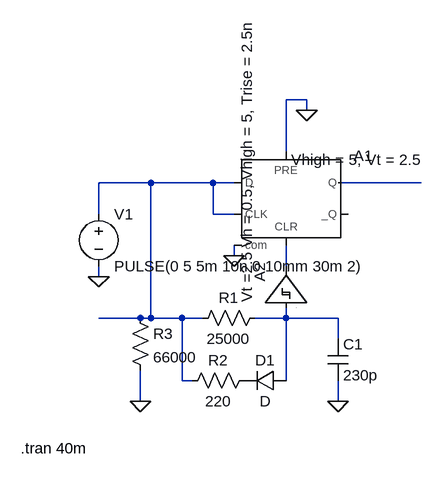
[diagram p0: schematic Dflop Transition Pulse Circuit TEST.asc]
Dflop Transition Pulse Circuit TEST.asc, the LTspice schematic file:
Version 4.1
SHEET 1 880 680
WIRE 496 -128 464 -128
WIRE 496 -112 496 -128
WIRE 464 -48 464 -128
WIRE 256 0 176 0
WIRE 352 0 256 0
WIRE 384 0 352 0
WIRE 672 0 544 0
WIRE 176 48 176 0
WIRE 352 48 352 0
WIRE 384 48 352 48
WIRE 384 112 384 96
WIRE 464 128 464 96
WIRE 176 144 176 128
WIRE 240 208 176 208
WIRE 256 208 256 0
WIRE 256 208 240 208
WIRE 304 208 256 208
WIRE 336 208 304 208
WIRE 464 208 464 192
WIRE 464 208 416 208
WIRE 544 208 464 208
WIRE 544 240 544 208
WIRE 304 304 304 208
WIRE 320 304 304 304
WIRE 464 304 464 208
WIRE 240 336 240 288
WIRE 544 336 544 304
FLAG 384 112 0
FLAG 496 -112 0
FLAG 544 336 0
FLAG 240 336 0
FLAG 176 144 0
SYMBOL Digital\\dflop 464 -48 R0
WINDOW 3 8 12 Left 2
SYMATTR InstName A1
SYMATTR Value Vhigh = 5, Vt = 2.5
SYMBOL res 432 192 R90
WINDOW 0 0 56 VBottom 2
WINDOW 3 32 56 VTop 2
SYMATTR InstName R1
SYMATTR Value 25000
SYMBOL res 416 288 R90
WINDOW 0 0 56 VBottom 2
WINDOW 3 32 56 VTop 2
SYMATTR InstName R2
SYMATTR Value 220
SYMBOL diode 464 288 R90
WINDOW 0 0 32 VBottom 2
WINDOW 3 32 32 VTop 2
SYMATTR InstName D1
SYMBOL cap 528 240 R0
SYMATTR InstName C1
SYMATTR Value 230p
SYMBOL res 224 192 R0
SYMATTR InstName R3
SYMATTR Value 66000
SYMBOL voltage 176 32 R0
WINDOW 123 0 0 Left 0
WINDOW 39 0 0 Left 0
SYMATTR InstName V1
SYMATTR Value PULSE(0 5 5m 10n 0 10mm 30m 2)
SYMBOL Digital\\schmtbuf 400 192 R270
WINDOW 3 8 4 Left 2
SYMATTR InstName A2
SYMATTR Value Vt =2.5 Vh = 0.5, Vhigh = 5, Trise = 2.5n
TEXT 56 408 Left 2 !.tran 40m

The netlist it stands for:
* Dflop Transition Pulse Circuit TEST.asc
A1 N001 0 N001 0 N003 0 N002 0 DFLOP Vhigh = 5, Vt = 2.5
R1 N004 N001 25000
R2 P001 N001 220
D1 N004 P001 D
C1 N004 0 230p
R3 N001 0 66000
V1 N001 0 PULSE(0 5 5m 10n 0 10mm 30m 2)
A2 N004 0 0 0 0 0 N003 0 SCHMITT Vt =2.5 Vh = 0.5, Vhigh = 5, Trise = 2.5n
.model D D
.lib standard.dio
.tran 40m
.backanno
.end